# Altium project CW308T_AURIX.PrjPcb
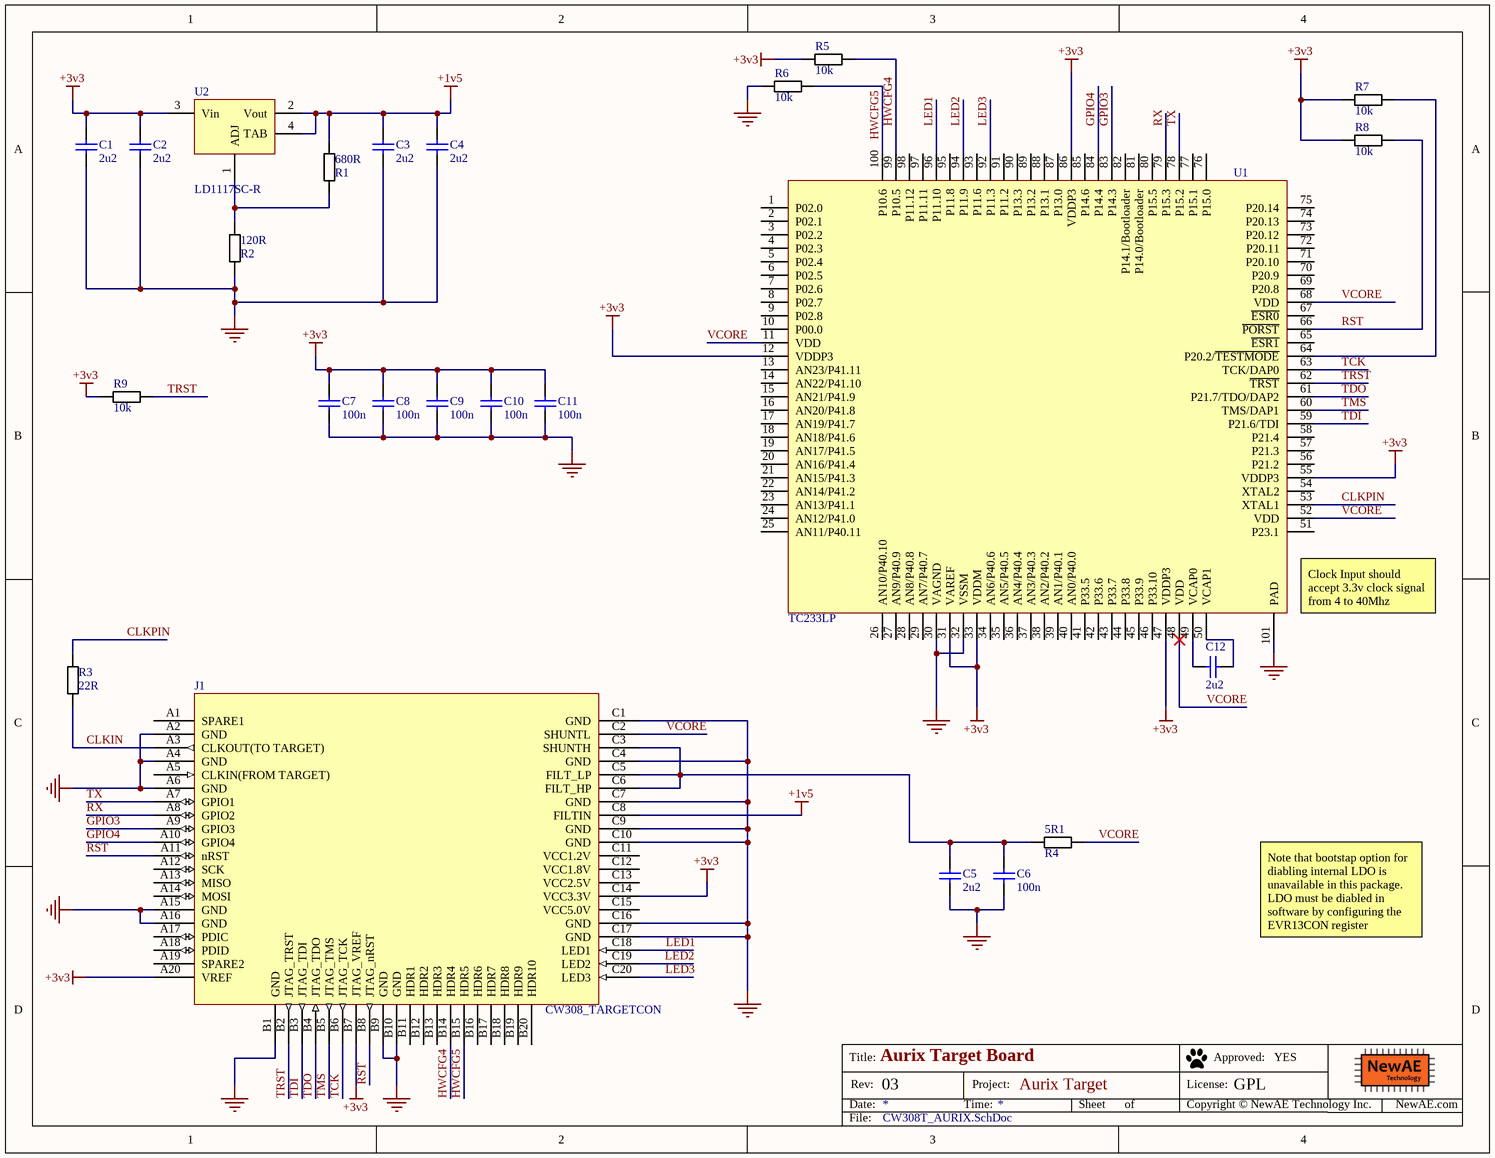
[diagram p0: CW308T_AURIX.SchDoc]
PrjRev: 03; PrjName: Aurix Target; PrjLicense: GPL
1 sheet, 24 parts. Net scope: global (net labels, ports and power ports of the same name join across sheets).
Board files: CW308T_AURIX.PcbDoc, CW308T_AURIX_PANEL.PcbDoc

## Sheet CW308T_AURIX.SchDoc: Aurix Target Board
size Letter; Organization: NewAE Technology Inc.; Address1: 1083 Queen St., Suite 196; Address2: Halifax; Address3: NS; Address4: Canada B3H 0B2; SheetApproved: YES

### Parts
C1  2u2  [CAPC0603_M]
C2  2u2  [CAPC0603_M]
C3  2u2  [CAPC0603_M]
C4  2u2  [CAPC0603_M]
C5  2u2  [CAPC0603_M]
C6  100n  [CAPC0603_M]
C7  100n  [CAPC0603_M]
C8  100n  [CAPC0603_M]
C9  100n  [CAPC0603_M]
C10  100n  [CAPC0603_M]
C11  100n  [CAPC0603_M]
C12  2u2  [CAPC0603_M]
J1  CW308_TARGETCON  [CW308_TBOARD_CONN]
R1  680R  [RESC1608X55N]
R2  120R  [RESC1608X55N]
R3  22R  [RESC1608X55N]
R4  5R1  [RESC1608X55N]
R5  10k  [RESC1608X55N]
R6  10k  [RESC1608X55N]
R7  10k  [RESC1608X55N]
R8  10k  [RESC1608X55N]
R9  10k  [RESC1608X55N]
U1  TC233LP  [PG-TQFP-100-23]
U2  LD1117SC-R

### Nets
+1v5: C3.1 C4.1 J1.C8(FILTIN) R1.1 U2.2(Vout) U2.4(TAB)
+3v3: C1.1 C2.1 C7.1 C8.1 C9.1 C10.1 C11.1 J1.A20(VREF) J1.B7(JTAG_VREF) J1.C14(VCC3.3V) R5.1 R7.2 R8.1 R9.1 U1.12(VDDP3) U1.31(VAREF) U1.33(VDDM) U1.47(VDDP3) U1.55(VDDP3) U1.86(VDDP3) U2.3(Vin)
GND: C1.2 C2.2 C3.2 C4.2 C5.2 C6.2 C7.2 C8.2 C9.2 C10.2 C11.2 J1.A2(GND) J1.A4(GND) J1.A6(GND) J1.A15(GND) J1.A16(GND) J1.B1(GND) J1.B9(GND) J1.B10(GND) J1.C1(GND) J1.C4(GND) J1.C7(GND) J1.C9(GND) J1.C10(GND) J1.C16(GND) J1.C17(GND) R2.2 R6.1 U1.30(VAGND) U1.32(VSSM) U1.101(PAD)
CLKIN: J1.A3(CLKOUT(TO_TARGET)) R3.2
CLKPIN: R3.1 U1.53(XTAL1)
GPIO3: J1.A9(GPIO3) U1.83(P14.3)
GPIO4: J1.A10(GPIO4) U1.84(P14.4)
HWCFG4: J1.B14(HDR4) R5.2 U1.99(P10.5)
HWCFG5: J1.B15(HDR5) R6.2 U1.100(P10.6)
LED1: J1.C18(LED1) U1.96(P11.10)
LED2: J1.C19(LED2) U1.94(P11.9)
LED3: J1.C20(LED3) U1.92(P11.3)
RST: J1.A11(nRST) J1.B8(JTAG_nRST) R8.2 U1.66(~{PORST})
RX: J1.A8(GPIO2) U1.79(P15.3)
TCK: J1.B6(JTAG_TCK) U1.63(TCK/DAP0)
TDI: J1.B3(JTAG_TDI) U1.59(P21.6/TDI)
TDO: J1.B4(JTAG_TDO) U1.61(P21.7/TDO/DAP2)
TMS: J1.B5(JTAG_TMS) U1.60(TMS/DAP1)
TRST: J1.B2(JTAG_TRST) R9.2 U1.62(~{TRST})
TX: J1.A7(GPIO1) U1.78(P15.2)
VCORE: J1.C2(SHUNTL) R4.2 U1.11(VDD) U1.48(VDD) U1.52(VDD) U1.68(VDD)
NetC5_1: C5.1 C6.1 J1.C3(SHUNTH) J1.C5(FILT_LP) J1.C6(FILT_HP) R4.1
NetC12_1: C12.1 U1.49(VCAP0)
NetC12_2: C12.2 U1.50(VCAP1)
NetR1_2: R1.2 R2.1 U2.1(ADJ)
NetR7_1: R7.1 U1.64(P20.2/~{TESTMODE})

Not connected (* = marked no-connect by the designer): J1 A1(SPARE1) A5(CLKIN(FROM_TARGET)) A12(SCK) A13(MISO) A14(MOSI) A17(PDIC) A18(PDID) A19(SPARE2) B11(HDR1) B12(HDR2) B13(HDR3) B16(HDR6) B17(HDR7) B18(HDR8) B19(HDR9) B20(HDR10) C11(VCC1.2V) C12(VCC1.8V) C13(VCC2.5V) C15(VCC5.0V); U1 1(P02.0) 2(P02.1) 3(P02.2) 4(P02.3) 5(P02.4) 6(P02.5) 7(P02.6) 8(P02.7) 9(P02.8) 10(P00.0) 13(AN23/P41.11) 14(AN22/P41.10) 15(AN21/P41.9) 16(AN20/P41.8) 17(AN19/P41.7) 18(AN18/P41.6) 19(AN17/P41.5) 20(AN16/P41.4) 21(AN15/P41.3) 22(AN14/P41.2) 23(AN13/P41.1) 24(AN12/P41.0) 25(AN11/P40.11) 26(AN10/P40.10) 27(AN9/P40.9) 28(AN8/P40.8) 29(AN7/P40.7) 34(AN6/P40.6) 35(AN5/P40.5) 36(AN4/P40.4) 37(AN3/P40.3) 38(AN2/P40.2) 39(AN1/P40.1) 40(AN0/P40.0) 41(P33.5) 42(P33.6) 43(P33.7) 44(P33.8) 45(P33.9) 46(P33.10) 51(P23.1) 54(XTAL2) 56(P21.2) 57(P21.3) 58(P21.4) 65(~{ESR1}) 67(~{ESR0}) 69(P20.8) 70(P20.9) 71(P20.10) 72(P20.11) 73(P20.12) 74(P20.13) 75(P20.14) 76(P15.0) 77(P15.1) 80(P15.5) 81(P14.0/Bootloader) 82(P14.1/Bootloader) 85(P14.6) 87(P13.0) 88(P13.1) 89(P13.2) 90(P13.3) 91(P11.2) 93(P11.6) 95(P11.8) 97(P11.11) 98(P11.12)

### Notes on the sheet
- (near U1) Clock Input should accept 3.3v clock signal from 4 to 40Mhz
- Note that bootstap option for diabling internal LDO is unavailable in this package. LDO must be diabled in software by configuring the EVR13CON register
- Title:
- Date:
- Rev:
- Time:
- Project:
- Sheet
- of
- License:
- Copyright © NewAE Technology Inc.
- Approved:
- NewAE.com
- File:

### Library data of the parts
C1-C5 C12 = CCHIP-2u2-0603: 2u2, 0603; Manufacture 1: Samsung; Manufacture Part Number 1: CL10B225KP8NNNC; Component Group: Capacitor; Case-EIA: 0603; Case-Metric: 1608; Rated Voltage: 10VDC; Part Number: CCHIP-2u2-0603; Footprint: 0603; Pin Count: 2; Supplier 1: Digi-Key; Supplier Part Number 1: 1276-1134-2-ND; Value: 2u2; Mounting Technology: SMT; Component Kind: Standard; Component Type: Standard
C6-C11 = CCHIP-100n-0603: 100n, 0603; Manufacture 1: Kemet; Manufacture Part Number 1: C0603C104K5RACTU; Component Group: Capacitor; Case-EIA: 0603; Case-Metric: 1608; Rated Voltage: 50VDC; Part Number: CCHIP-100n-0603; Footprint: 0603; Pin Count: 2; Supplier 1: Digi-Key; Supplier Part Number 1: 399-5089-2-ND; Value: 100n; Mounting Technology: SMT; Component Kind: Standard; Component Type: Standard
J1 = CW308_TBOARD: CW308 "Standard" Target Board Connector; Component Group: Mechanical; Pitch: 2.54mm; Part Number: CW308_TBOARD; Pin Count: 60; Mounting Technology: Through-hole; Component Kind: Standard; Component Type: Standard
R1 = RCHIP-680R-0603: 680R res, 0603, 1%, 1/10W; Manufacture 1: Yageo; Manufacture Part Number 1: RC0603FR-07680RL; Component Group: Resistor; Case-EIA: 0603; Case-Metric: 1608; Rated Power: 0.1W; Rated Voltage: 75VDC; Part Number: RCHIP-680R-0603; Footprint: 0603; Pin Count: 2; Supplier 1: Digi-Key; Supplier Part Number 1: 311-680HRCT-ND; Value: 680R; Tolerance: 1%; Mounting Technology: SMT; Temperature Range: -55C to 155C; Component Kind: Standard; Component Type: Standard
R2 = RCHIP-120R-0603: 120R res, 0603, 1%, 1/10W; Manufacture 1: Yageo; Manufacture Part Number 1: RC0603FR-07120RL; Component Group: Resistor; Case-EIA: 0603; Case-Metric: 1608; Rated Power: 0.1W; Rated Voltage: 75VDC; Part Number: RCHIP-120R-0603; Footprint: 0603; Pin Count: 2; Supplier 1: Digi-Key; Supplier Part Number 1: 311-120HRCT-ND; Value: 120R; Tolerance: 1%; Mounting Technology: SMT; Temperature Range: -55C to 155C; Component Kind: Standard; Component Type: Standard
R3 = RCHIP-22R-0603: 22R res, 0603, 1%, 1/10W; Manufacture 1: Yageo; Manufacture Part Number 1: RC0603FR-0722RL; Component Group: Resistor; Case-EIA: 0603; Case-Metric: 1608; Rated Power: 0.1W; Rated Voltage: 75VDC; Part Number: RCHIP-22R-0603; Footprint: 0603; Pin Count: 2; Supplier 1: Digi-Key; Supplier Part Number 1: 311-22.0HRCT-ND; Value: 22R; Tolerance: 1%; Mounting Technology: SMT; Temperature Range: -55C to 155C; Component Kind: Standard; Component Type: Standard
R4 = RCHIP-5R1-0603: 5R1 res, 0603, 1%, 1/10W; Manufacture 1: Yageo; Manufacture Part Number 1: RC0603FR-075R1L; Component Group: Resistor; Case-EIA: 0603; Case-Metric: 1608; Rated Power: 0.1W; Rated Voltage: 75VDC; Part Number: RCHIP-5R1-0603; Footprint: 0603; Pin Count: 2; Supplier 1: Digi-Key; Supplier Part Number 1: YAG3372CT-ND; Value: 5R1; Tolerance: 1%; Mounting Technology: SMT; Temperature Range: -55C to 155C; Component Kind: Standard; Component Type: Standard
R5-R9 = RCHIP-10K-0603: 10k res, 0603, 1%, 1/10W; Manufacture 1: Yageo; Manufacture Part Number 1: RC0603FR-0710KL; Component Group: Resistor; Case-EIA: 0603; Case-Metric: 1608; Rated Power: 0.1W; Rated Voltage: 75VDC; Part Number: RCHIP-10K-0603; Footprint: 0603; Pin Count: 2; Supplier 1: Digi-Key; Supplier Part Number 1: 311-10.0KHRCT-ND; Value: 10k; Tolerance: 1%; Mounting Technology: SMT; Temperature Range: -55C to 155C; Component Kind: Standard; Component Type: Standard
U1 = TC233LP: IC MCU 32BIT 2MB FLASH 100TQFP; Manufacture 1: Infineon Technologies; Manufacture Part Number 1: TC233LP32F200FABKXUMA1; Component Group: Digital IC; PP Material Stack: 0; Part Number: TC233LP; Footprint: TQFP-100; Pin Count: 100; Supplier 1: Digi-Key; Supplier Part Number 1: TC233LP32F200FABKXUMA1CT-ND; Mounting Technology: SMT; RoHS: Yes; Component Kind: Standard; Component Type: Standard; PP Rotation: 0